# EAGLE design SHT1x-Breakout-v13 (EAGLE 5.04)
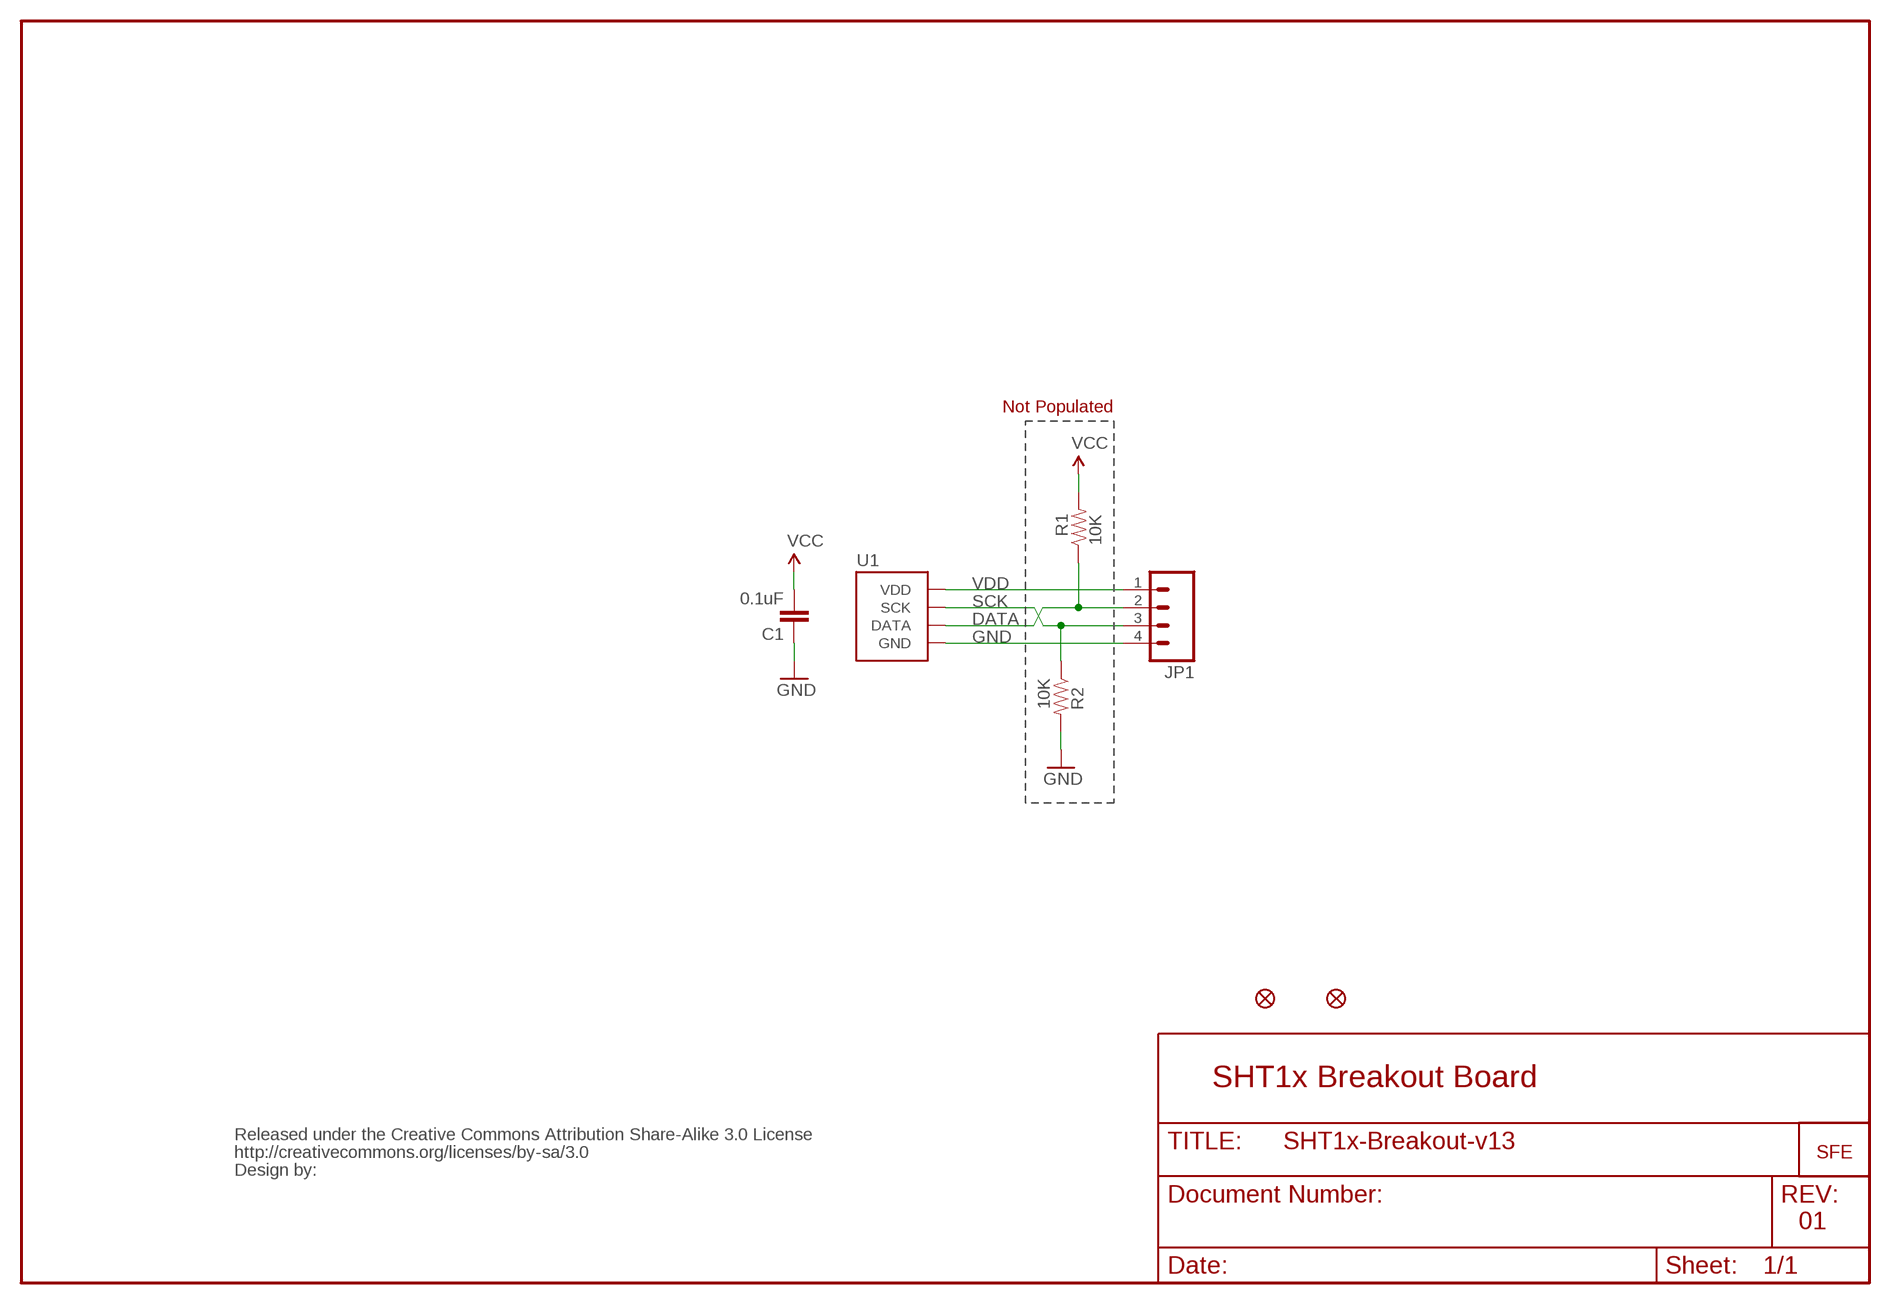
[diagram p0: schematic, sheet 1]

## Parts
C1  0.1uF  CAP0603-CAP  [0603-CAP]
JP1  M04PTH  [1X04]
R1  10K  RESISTOR0603-RES  [0603-RES]
R2  10K  RESISTOR0603-RES  [0603-RES]
U1  SHT1XSMD  [SHT1X]
U$1  LOGO-SFENEW  [SFE-NEW-WEBLOGO]
U$2  FIDUCIAL1X2  [FIDUCIAL-1X2]
U$3  FIDUCIAL1X2  [FIDUCIAL-1X2]
U$4  CREATIVE_COMMONS  [CREATIVE_COMMONS]

## Nets
DATA: JP1.2 R1.1 U1.2(DATA)
GND: C1.1 JP1.4 R2.2 U1.1(GND)
SCK: JP1.3 R2.1 U1.3(SCK)
VDD: C1.2 JP1.1 R1.2 U1.4(VDD) ; supply symbol labelled VCC

## Notes on the sheet
- Not Populated
- SHT1x Breakout Board
- 01

## Library data of the parts
C1 = SparkFun:CAP: Capacitor Standard 0603 ceramic capacitor, and 0.1" leaded capacitor.
JP1 = SparkFun:M04: Header 4 Standard 4-pin 0.1" header. Use with straight break away headers (SKU : PRT-00116), right angle break away headers (PRT-00553), swiss pins (PRT-00743), machine pins (PRT-00117), and female headers (PRT-00115). Molex polarized connector foot print use with SKU : PRT-08231 with associated crimp pins and housings.
R1 R2 = SparkFun:RESISTOR: Resistor Basic schematic elements and footprints for 0603, 1206, and PTH 1/10th watt (small) resistors.
U1 = SparkFun:SHT1X: SHT1x Humdity Sensor Sensirion humdity sensor. Schematic element and footprint proven. Spark Fun Electronics SKU : COM-08227
U$1 = SparkFun:LOGO-SFE: Spark Fun Electronics PCB Logo This is the standard Spark Fun Electronics PCB logo.
U$2 U$3 = SparkFun:FIDUCIAL: Fiducial Alignment Points Various fiducial points for machine vision alignment.
U$4 = SparkFun:CREATIVE_COMMONS

## Net classes
0 default: width 0.203 mm
1 power: width 0.305 mm

## Board
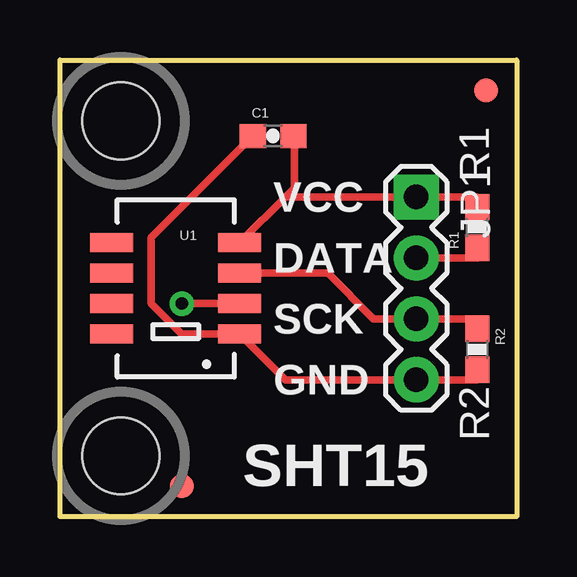
[diagram p1: board, top side]
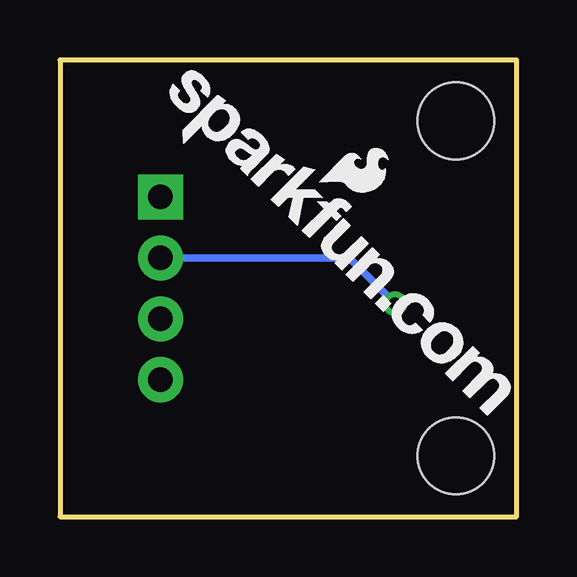
[diagram p2: board, bottom side, seen from below]

Size 19.05 x 19.05 mm. Coordinates in mm from the lower left corner, seen from the top.
Outline: 0,19.05 19.05,19.05 19.05,0 0,0 0,19.05
Copper layers (1*16): Top 0.035mm / dielectric 1.5mm / Bottom 0.035mm
Design rules "SparkFun": minimum track width 8mil, minimum drill 20mil, track to track 8mil, track to pad 8mil, pad to pad 8mil, via to via 8mil, smd to smd 8mil, copper to edge 9mil, drill to drill 8mil, minimum pad ring 12mil, minimum via ring 10mil, stop-mask expansion 4mil, vias tented up to drill 20mil, thermal gap 10mil
Holes 3.2 mm at 2.54,16.51 2.54,2.54

### Footprints (pad centres in the part's own frame; a part is rotated, then mirrored left to right if it is on the bottom)
0603-CAP = smd 1.1 x 1: 1 -0.85,0; 2 0.85,0
1X04 = drill 1.016 pad 1.88 square: 1 0,0 | drill 1.016 pad 1.88 round: 2 2.54,0; 3 5.08,0; 4 7.62,0
0603-RES = smd 1.1 x 1: 1 -0.85,0; 2 0.85,0
SHT1X = smd 1.8 x 0.8: 1 -2.667,1.905; 2 -2.667,0.635; 3 -2.667,-0.635; 4 -2.667,-1.905; 5 2.667,-1.905; 6 2.667,-0.635; 7 2.667,0.635; 8 2.667,1.905
FIDUCIAL-1X2 = smd 1 x 1: 1 0,0

### Placement (x,y rotation side)
C1  8.89,15.88 0 top
JP1  14.86,13.34 270 top
R1  17.4,12.06 90 top
R2  17.4,6.99 270 top
U1  4.83,9.53 180 top
U$1  15.37,17.02 315 bottom
U$2  17.78,17.78 0 top
U$3  5.08,1.27 0 top
U$4  19.05,-8.89 0 top  (outside the outline)

### Tracks (layer width: path | path; a pad name or v marks a point on that pad's centre or on a via)
DATA  (via drill 0.51)
  Top 0.305: R1.1 17.4,10.79 JP1.2 | U1.2 v5.08,8.89
  Bottom 0.305: v5.08,8.89 6.99,10.79 JP1.2
GND
  Top 0.305: R2.2 17.4,5.71 JP1.4 9.4,5.71 U1.1 5.08,7.62 3.81,8.89 3.81,11.64 C1.1
SCK
  Top 0.305: U1.3 11.18,10.16 13.08,8.26 JP1.3 17.27,8.26 17.27,7.96 R2.1
VDD
  Top 0.305: C1.2 9.78,15.84 9.78,13.72 9.46,13.4 | U1.4 9.46,13.4 | 9.46,13.4 9.53,13.34 JP1.1 17.4,13.34 R1.2

### Text on the board
tPlace: R1 | VCC | DATA | SCK | GND | R2 | SHT15